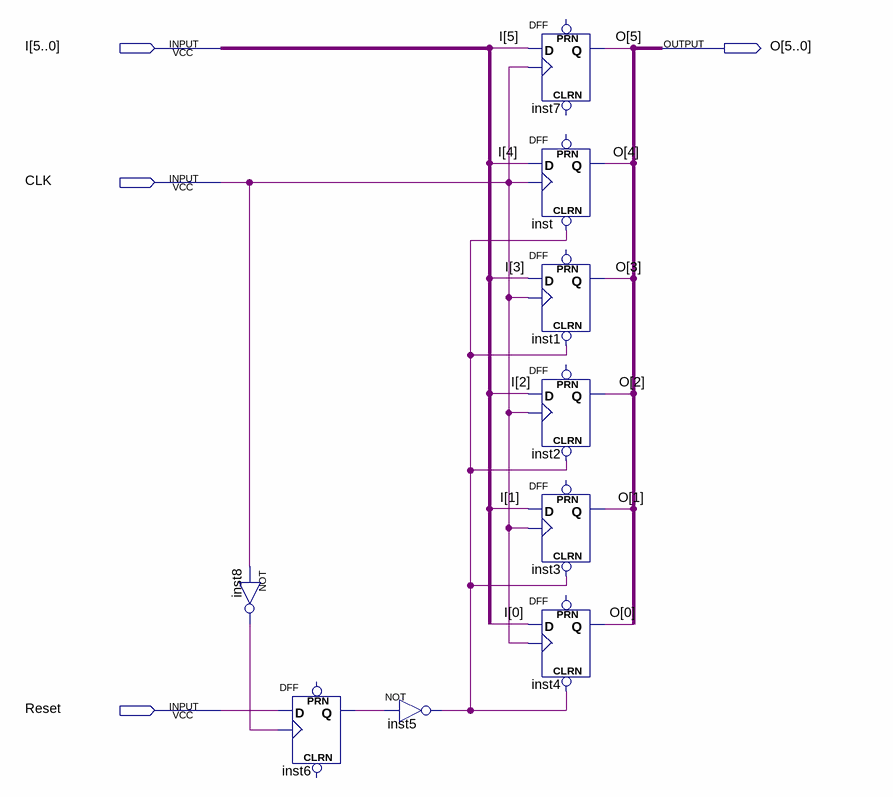
[diagram p0: schematic sheet]
// Quartus schematic register6_clr.bdf as structural Verilog: 9 symbols, 4 pins
module register6_clr (
  input  [5:0] I,
  input  CLK,
  input  Reset,
  output [5:0] O
);

  wire inst5_out, inst6_q, inst8_out;

  not inst8 (inst8_out, CLK);
  DFF inst6 (.CLK(inst8_out), .D(Reset), .Q(inst6_q));  // open: CLRN, PRN
  not inst5 (inst5_out, inst6_q);
  DFF inst7 (.CLK(CLK), .D(I[5]), .Q(O[5]));  // open: CLRN, PRN
  DFF inst (.CLRN(inst5_out), .CLK(CLK), .D(I[4]), .Q(O[4]));  // open: PRN
  DFF inst1 (.CLRN(inst5_out), .CLK(CLK), .D(I[3]), .Q(O[3]));  // open: PRN
  DFF inst2 (.CLRN(inst5_out), .CLK(CLK), .D(I[2]), .Q(O[2]));  // open: PRN
  DFF inst3 (.CLRN(inst5_out), .CLK(CLK), .D(I[1]), .Q(O[1]));  // open: PRN
  DFF inst4 (.CLRN(inst5_out), .CLK(CLK), .D(I[0]), .Q(O[0]));  // open: PRN
endmodule
